# EAGLE design color-detector (EAGLE 6.4)
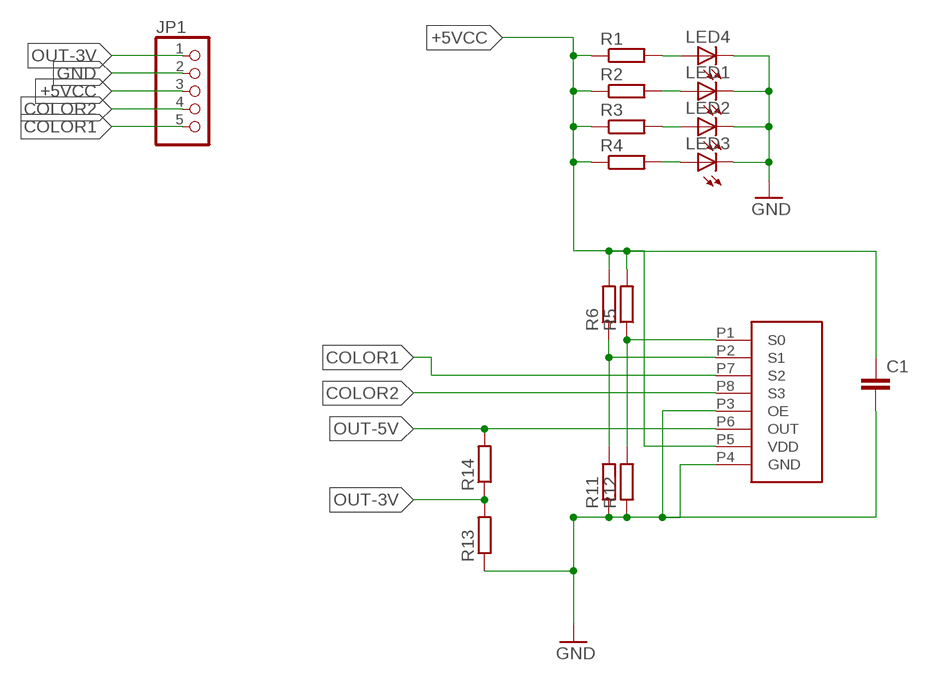
[diagram p0: schematic, sheet 1]

## Parts
C1  C-EUC0805  [C0805]
JP1  PINHD-1X5/90  [1X05/90]
LED1  LED3MM  [LED3MM]
LED2  LED3MM  [LED3MM]
LED3  LED3MM  [LED3MM]
LED4  LED3MM  [LED3MM]
R1  R-EU_R0805  [R0805]
R2  R-EU_R0805  [R0805]
R3  R-EU_R0805  [R0805]
R4  R-EU_R0805  [R0805]
R5  R-EU_R0402  [R0402]
R6  R-EU_R0402  [R0402]
R11  R-EU_R0402  [R0402]
R12  R-EU_R0402  [R0402]
R13  R-EU_R0805  [R0805]
R14  R-EU_R0805  [R0805]
U$1  TCS3200  [SOIC8]

## Nets
+5VCC: C1.1 JP1.3 R1.1 R2.1 R3.1 R4.1 R5.2 R6.2 U$1.P5(VDD)
COLOR1: JP1.5 U$1.P7(S2)
COLOR2: JP1.4 U$1.P8(S3)
GND: C1.2 JP1.2 LED1.K(C) LED2.K(C) LED3.K(C) LED4.K(C) R11.1 R12.1 R13.1 U$1.P3(OE) U$1.P4(GND)
N$1: LED4.A R1.2
N$2: LED1.A R2.2
N$3: LED2.A R3.2
N$4: LED3.A R4.2
N$5: R5.1 R12.2 U$1.P1(S0)
N$6: R6.1 R11.2 U$1.P2(S1)
OUT-3V: JP1.1 R13.2 R14.1
OUT-5V: R14.2 U$1.P6(OUT)

## Library data of the parts
C1 = rcl:C-EU: CAPACITOR, European symbol
JP1 = pinhead:PINHD-1X5: PIN HEADER
LED1-LED4 = led:LED: LED OSRAM: - CHIPLED LG R971, LG N971, LY N971, LG Q971, LY Q971, LO R971, LY R971 LH N974, LH R974 LS Q976, LO Q976, LY Q976 LO Q996 - Hyper CHIPLED LW Q18S LB Q993, LB Q99A, LB R99A - SideLED LS A670, LO A670, LY A670, LG A670, LP A670 LB A673, LV A673, LT A673, LW A673 LH A674 LY A675 LS A676, LA A676, LO A676, LY A676, LW A676 LS A679, LY A679, LG A679 - Hyper Micro SIDELED® LS Y876, LA Y876, LO Y876, LY Y876 LT Y87S - SmartLED LW L88C, LW L88S LB L89C, LB L89S, LG L890 LS L89K, LO L89K, LY L89K LS L896, LA L896, LO L896, LY L896 - TOPLED LS T670, LO T670, LY T670, LG T670, LP T670 LSG T670, LSP T670, LSY T670, LOP T670, LYG T670 LG T671, LOG T671, LSG T671 LB T673, LV T673, LT T673, LW T673 LH T674 LS T676, LA T676, LO T676, LY T676, LB T676, LH T676, LSB T676, LW T676 LB T67C, LV T67C, LT T67C, LS T67K, LO T67K, LY T67K, LW E67C LS E67B, LA E67B, LO E67B, LY E67B, LB E67C, LV E67C, LT E67C LW T67C LS T679, LY T679, LG T679 LS T770, LO T770, LY T770, LG T770, LP T770 LB T773, LV T773, LT T773, LW T773 LH T774 LS E675, LA E675, LY E675, LS T675 LS T776, LA T776, LO T776, LY T776, LB T776 LHGB T686 LT T68C, LB T68C - Hyper Mini TOPLED® LB M676 - Mini TOPLED Santana® LG M470 LS M47K, LO M47K, LY M47K Source: http://www.osram.convergy.de LUXEON: - LUMILED® LXK2-PW12-R00, LXK2-PW12-S00, LXK2-PW14-U00, LXK2-PW14-V00 LXK2-PM12-R00, LXK2-PM12-S00, LXK2-PM14-U00 LXK2-PE12-Q00, LXK2-PE12-R00, LXK2-PE12-S00, LXK2-PE14-T00, LXK2-PE14-U00 LXK2-PB12-K00, LXK2-PB12-L00, LXK2-PB12-M00, LXK2-PB14-N00, LXK2-PB14-P00, LXK2-PB14-Q00 LXK2-PR12-L00, LXK2-PR12-M00, LXK2-PR14-Q00, LXK2-PR14-R00 LXK2-PD12-Q00, LXK2-PD12-R00, LXK2-PD12-S00 LXK2-PH12-R00, LXK2-PH12-S00 LXK2-PL12-P00, LXK2-PL12-Q00, LXK2-PL12-R00 Source: www.luxeon.com KINGBRIGHT: KA-3528ASYC Source: www.kingbright.com
R1-R6 R11-R14 = rcl:R-EU_: RESISTOR, European symbol
U$1 = ts3200:TCS3200

## Board
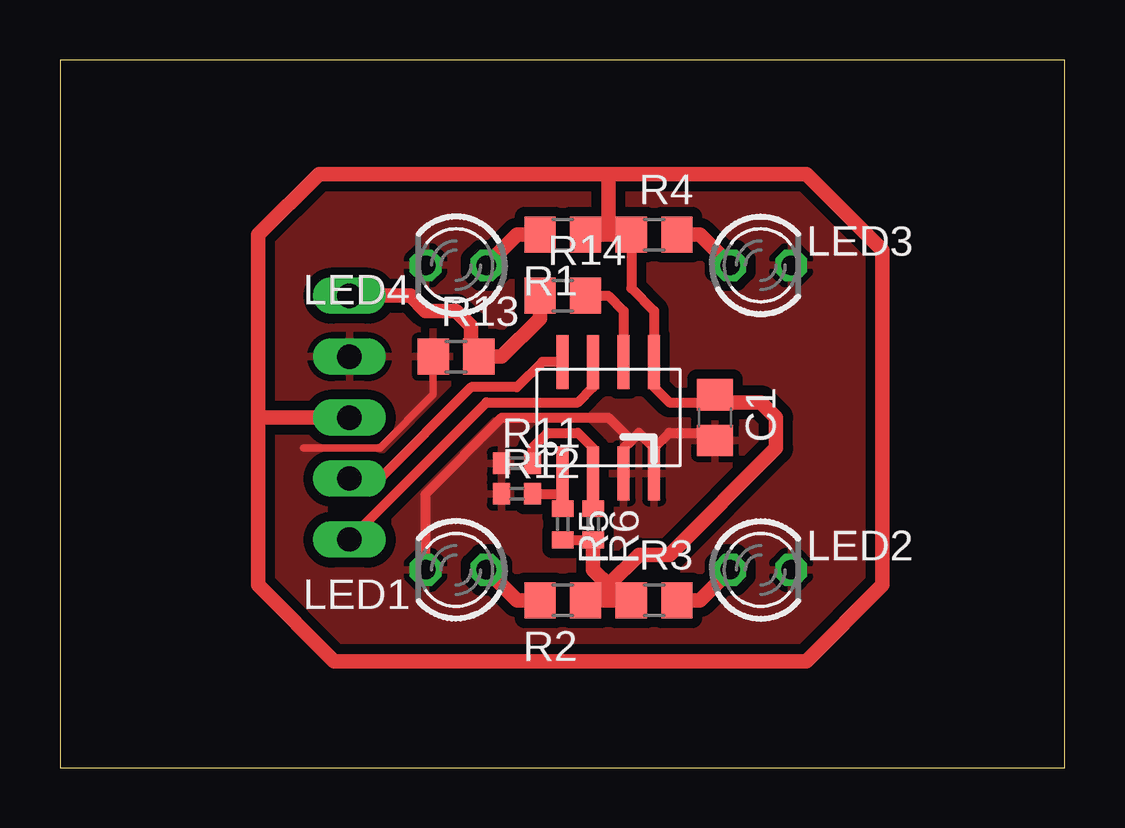
[diagram p1: board, top side]
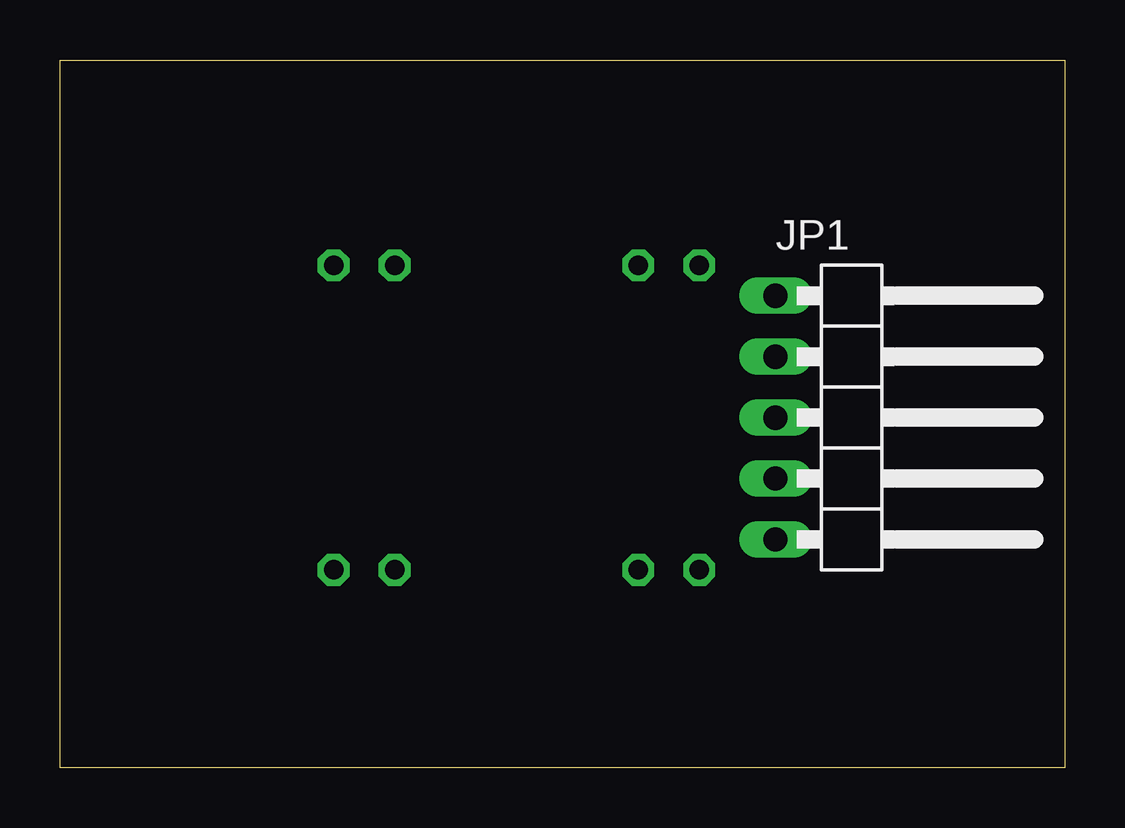
[diagram p2: board, bottom side, seen from below]

Size 41.89 x 29.52 mm. Coordinates in mm from the lower left corner, seen from the top.
Outline: 0,0 41.89,0 41.89,29.52 0,29.52 0,0
Copper layers (1*16): Top 0.035mm / dielectric 1.5mm / Bottom 0.035mm
Design rules "default": minimum track width 10mil, minimum drill 24mil, track to track 8mil, track to pad 8mil, pad to pad 8mil, via to via 8mil, smd to smd 8mil, copper to edge 40mil, drill to drill 8mil, minimum pad ring 10mil, minimum via ring 8mil, stop-mask expansion 4mil, vias tented up to drill 0mil, thermal gap 10mil

### Footprints (pad centres in the part's own frame; a part is rotated, then mirrored left to right if it is on the bottom)
C0805 = smd 1.3 x 1.5: 1 -0.95,0; 2 0.95,0
1X05/90 = drill 1.016 long: 1 -5.08,-3.81; 2 -2.54,-3.81; 3 0,-3.81; 4 2.54,-3.81; 5 5.08,-3.81
LED3MM = drill 0.813 octagon: A -1.27,0; K 1.27,0
R0805 = smd 1.3 x 1.5: 1 -0.95,0; 2 0.95,0
R0402 = smd 0.7 x 0.9: 1 -0.65,0; 2 0.65,0
SOIC8 = smd 0.5 x 2.25: P1 -1.905,-2.325; P2 -0.635,-2.325; P3 0.635,-2.325; P4 1.905,-2.325; P5 1.905,2.325; P6 0.635,2.325; P7 -0.635,2.325; P8 -1.905,2.325

### Placement (x,y rotation side)
C1  27.3,14.61 270 top
JP1  8.25,14.61 270 bottom
LED1  16.51,8.26 180 top
LED2  29.21,8.26 0 top
LED3  29.21,20.95 0 top
LED4  16.51,20.95 180 top
R1  20.95,22.23 180 top
R2  20.95,6.99 180 top
R3  24.77,6.99 0 top
R4  24.77,22.23 0 top
R5  20.95,10.16 270 top
R6  22.22,10.16 270 top
R11  19.05,12.7 0 top
R12  19.05,11.43 0 top
R13  16.51,17.14 0 top
R14  20.95,19.69 0 top
U$1  22.86,14.61 0 top

### Tracks (layer width: path | path; a pad name or v marks a point on that pad's centre or on a via)
+5VCC
  Top 0.406: C1.1 26.99,15.24 25.4,15.24 24.77,15.88 U$1.P5 24.77,19.05 23.81,20 R4.1 | R5.2 R6.2
  Top 0.61: 8.25,14.61 8.25,22.23 10.79,24.77 22.86,24.77 | 22.86,24.77 31.12,24.77 34.29,21.59 34.29,7.62 31.12,4.45 11.43,4.45 8.25,7.62 8.25,14.61 | 8.25,14.61 JP1.3 | 22.86,22.23 R1.1 | R4.1 22.86,22.23 | 22.86,22.23 22.86,24.77 | R3.1 R2.1 22.86,6.99 22.86,7.62 | 22.86,7.62 24.13,8.89 25.4,8.89 29.84,13.34 29.84,14.61 29.21,15.24 27.62,15.24 C1.1 | R6.2 22.22,8.26 22.86,7.62
COLOR1
  Top 0.406: JP1.5 17.78,15.24 21.59,15.24 22.22,15.88 U$1.P7
COLOR2
  Top 0.406: JP1.4 13.33,12.07 17.14,15.88 19.05,15.88 20.11,16.93 U$1.P8
GND
  Top 0.305: R13.1 15.56,15.56 13.33,13.34 10.16,13.34
  Top 0.406: 24.77,13.34 25.4,13.97 26.99,13.97 C1.2 | U$1.P4 24.77,13.34 | 24.77,13.34 24.13,13.97 23.81,13.65 | 23.81,13.65 23.5,13.34 U$1.P3 | LED1.K 15.24,11.43 18.41,14.61 22.86,14.61 23.81,13.65
  pour Top (isolate 0.406): 6.35,27.3 6.35,1.91 35.56,1.91 35.56,27.3
N$1
  Top 0.61: R1.2 19.05,22.23 LED4.A
N$2
  Top 0.61: R2.2 19.05,6.99 LED1.A
N$3
  Top 0.61: R3.2 26.67,6.99 LED2.A
N$4
  Top 0.61: R4.2 26.67,22.23 LED3.A
N$5
  Top 0.406: 20.95,12.7 U$1.P1 20.95,11.43 | R12.2 20.95,11.43 | R5.1 20.95,11.43
N$6
  Top 0.406: R11.2 19.7,13.35 20.32,13.97 21.59,13.97 22.22,13.34 U$1.P2 R6.1
OUT-3V
  Top 0.61: R14.1 20,18.73 18.41,17.14 R13.2 17.14,17.46 17.14,18.41 16.51,19.05 15.24,19.05 14.6,19.69 JP1.1
OUT-5V
  Top 0.406: R14.2 22.86,19.69 23.5,19.05 U$1.P6